# EAGLE design display (EAGLE 8.2.2)
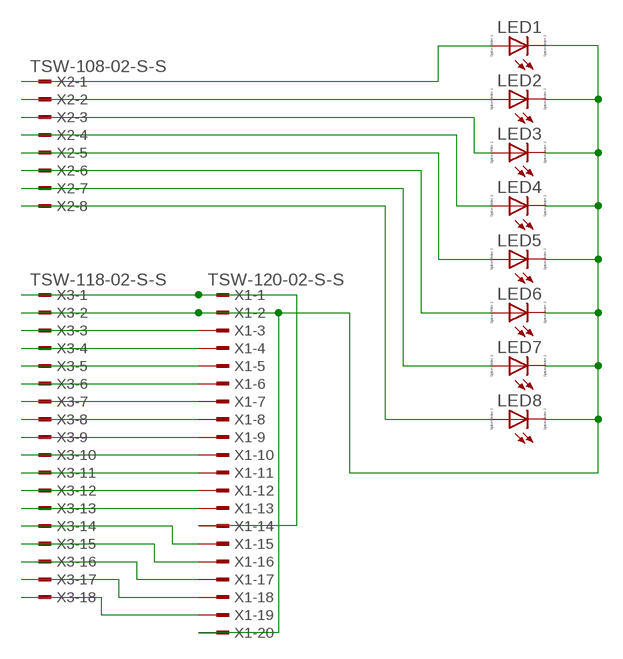
[diagram p0: schematic, sheet 1]

## Parts
LED1  LED_ELD260  [LED_LD260]
LED2  LED_ELD260  [LED_LD260]
LED3  LED_ELD260  [LED_LD260]
LED4  LED_ELD260  [LED_LD260]
LED5  LED_ELD260  [LED_LD260]
LED6  LED_ELD260  [LED_LD260]
LED7  LED_ELD260  [LED_LD260]
LED8  LED_ELD260  [LED_LD260]
X1  TSW-120-02-S-S  [TSW-120-02-S-S]
X2  TSW-108-02-S-S  [TSW-108-02-S-S]
X3  TSW-118-02-S-S  [TSW-118-02-S-S]

## Nets
GND: LED1.K(C) LED2.K(C) LED3.K(C) LED4.K(C) LED5.K(C) LED6.K(C) LED7.K(C) LED8.K(C) X1.2 X1.20 X3.2
N$1: X1.1 X1.14 X3.1
N$3: X1.3 X3.3
N$4: X1.4 X3.4
N$5: X1.5 X3.5
N$6: X1.6 X3.6
N$7: X1.7 X3.7
N$8: X1.8 X3.8
N$9: X1.9 X3.9
N$10: X1.10 X3.10
N$11: X1.11 X3.11
N$12: X1.12 X3.12
N$13: X1.13 X3.13
N$14: X1.15 X3.14
N$15: X1.16 X3.15
N$16: X1.17 X3.16
N$17: X1.18 X3.17
N$18: X1.19 X3.18
N$19: LED1.A X2.1
N$20: LED2.A X2.2
N$21: LED3.A X2.3
N$22: LED4.A X2.4
N$23: LED5.A X2.5
N$24: LED6.A X2.6
N$25: LED7.A X2.7
N$26: LED8.A X2.8

## Library data of the parts
LED1-LED8 = eagle-ltspice:LED_E: LED Source: http://www.osram.convergy.de Source: www.luxeon.com Source: www.kingbright.com; SPICEMODEL: NONE; SPICEPREFIX: D; SPICETYPE: diode
X1 = con-samtec:TSW-120-02-S-S: THROUGH-HOLE .025" SQ POST HEADER Source: Samtec TSW.pdf; OC_FARNELL: unknown; OC_NEWARK: unknown
X2 = con-samtec:TSW-108-02-S-S: THROUGH-HOLE .025" SQ POST HEADER Source: Samtec TSW.pdf; OC_FARNELL: unknown; OC_NEWARK: unknown
X3 = con-samtec:TSW-118-02-S-S: THROUGH-HOLE .025" SQ POST HEADER Source: Samtec TSW.pdf; OC_FARNELL: unknown; OC_NEWARK: unknown

## Board
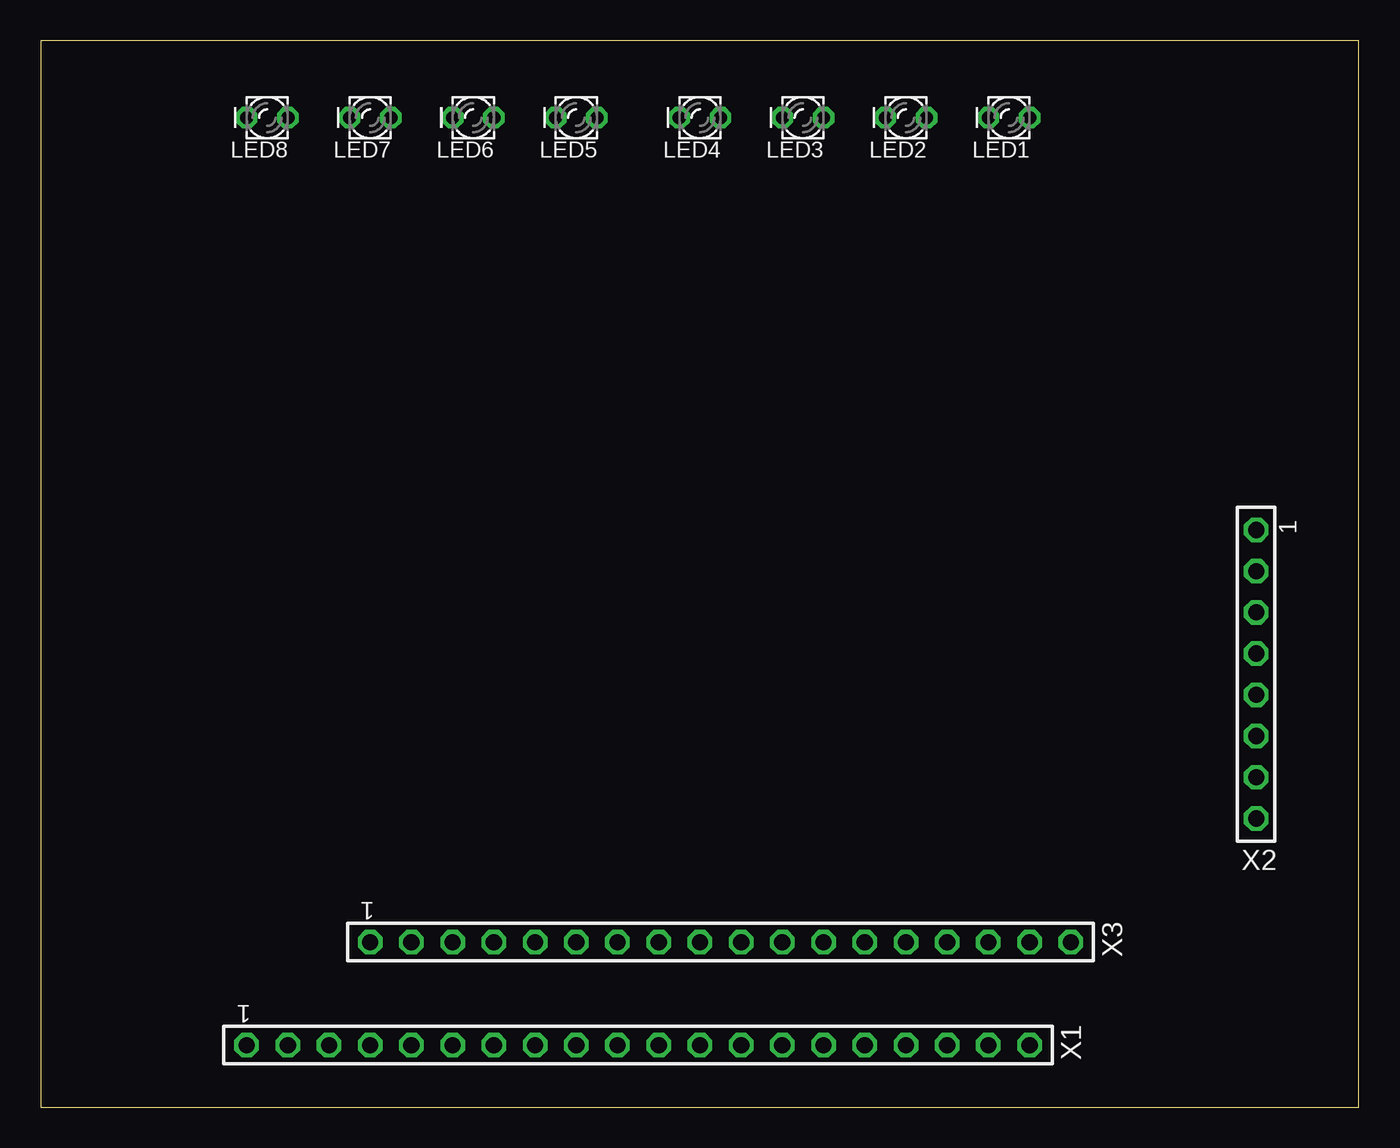
[diagram p1: board, top side]
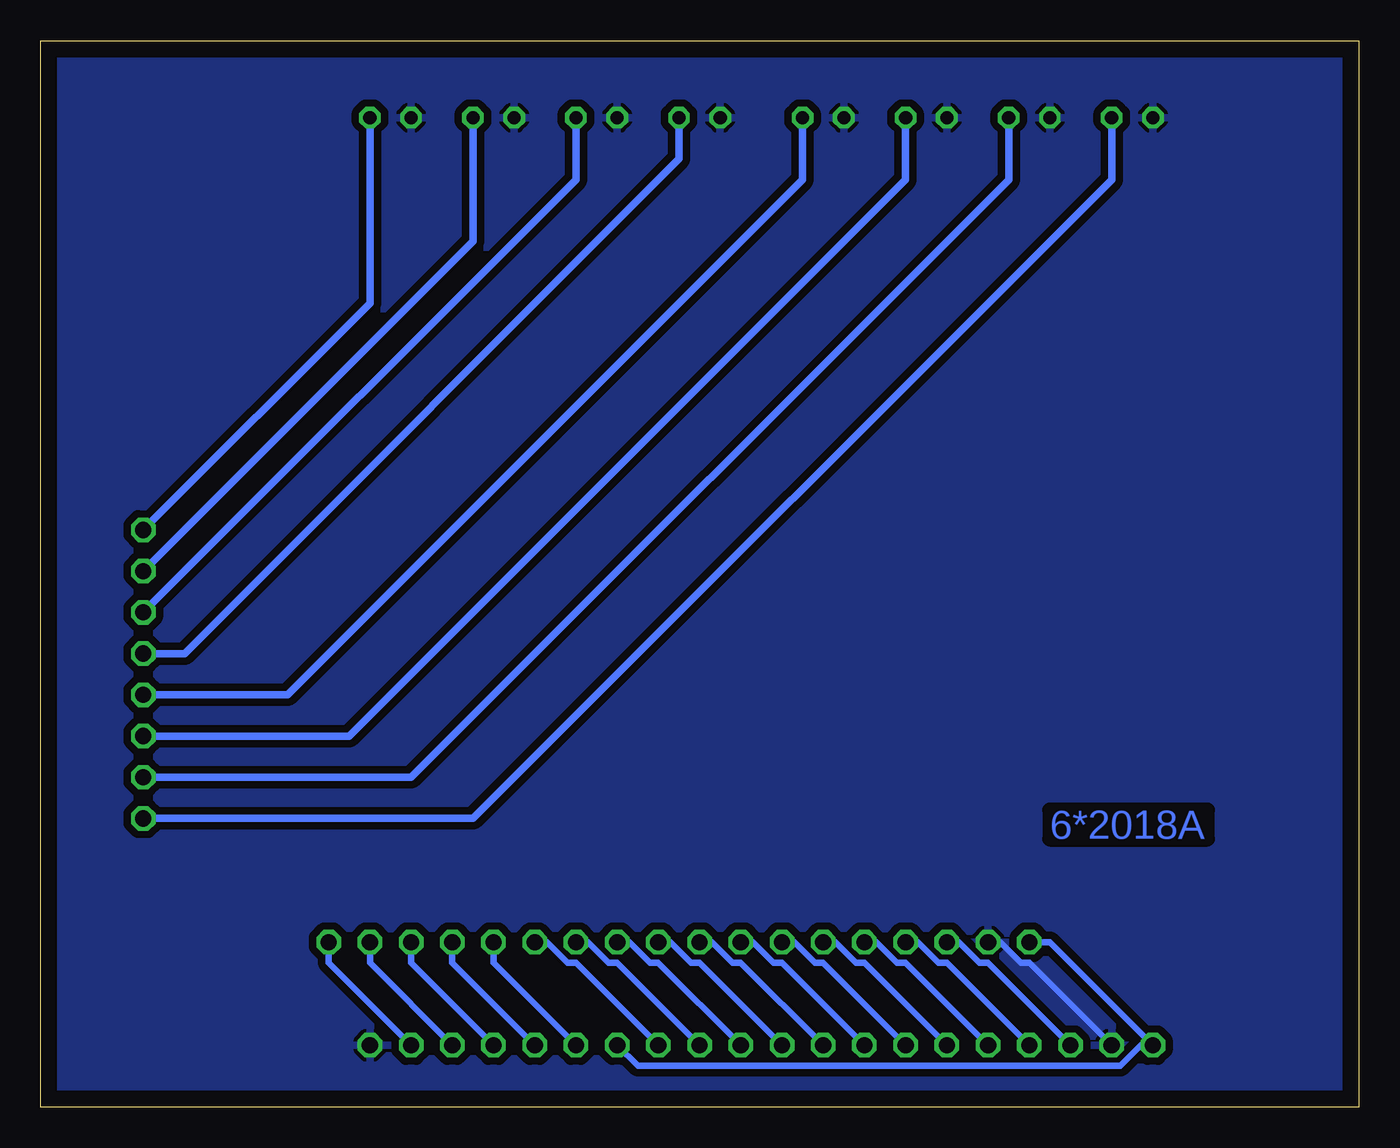
[diagram p2: board, bottom side, seen from below]

Size 81.26 x 65.71 mm. Coordinates in mm from the lower left corner, seen from the top.
Outline: 0,0 81.26,0 81.26,65.71 0,65.71 0,0
Copper layers (1*16): Top 0.035mm / dielectric 1.5mm / Bottom 0.035mm
Design rules "default *": minimum track width 6mil, minimum drill 0.35mm, track to track 12mil, track to pad 12mil, pad to pad 12mil, via to via 12mil, smd to smd 6mil, copper to edge 40mil, drill to drill 6mil, minimum pad ring 10mil, minimum via ring 8mil, stop-mask expansion 4mil, vias tented up to drill 0mil, thermal gap 10mil

### Footprints (pad centres in the part's own frame; a part is rotated, then mirrored left to right if it is on the bottom)
LED_LD260 = drill 0.813 octagon: A -1.27,0; K 1.27,0
TSW-120-02-S-S = drill 1 pad 1.5 octagon: 1 24.13,0; 2 21.59,0; 3 19.05,0; 4 16.51,0; 5 13.97,0; 6 11.43,0; 7 8.89,0; 8 6.35,0; 9 3.81,0; 10 1.27,0; 11 -1.27,0; 12 -3.81,0; 13 -6.35,0; 14 -8.89,0; 15 -11.43,0; 16 -13.97,0; 17 -16.51,0; 18 -19.05,0; 19 -21.59,0; 20 -24.13,0
TSW-108-02-S-S = drill 1 pad 1.5 octagon: 1 8.89,0; 2 6.35,0; 3 3.81,0; 4 1.27,0; 5 -1.27,0; 6 -3.81,0; 7 -6.35,0; 8 -8.89,0
TSW-118-02-S-S = drill 1 pad 1.5 octagon: 1 21.59,0; 2 19.05,0; 3 16.51,0; 4 13.97,0; 5 11.43,0; 6 8.89,0; 7 6.35,0; 8 3.81,0; 9 1.27,0; 10 -1.27,0; 11 -3.81,0; 12 -6.35,0; 13 -8.89,0; 14 -11.43,0; 15 -13.97,0; 16 -16.51,0; 17 -19.05,0; 18 -21.59,0

### Placement (x,y rotation side)
LED1  59.69,60.96 180 top
LED2  53.34,60.96 180 top
LED3  46.99,60.96 180 top
LED4  40.64,60.96 180 top
LED5  33.02,60.96 180 top
LED6  26.67,60.96 180 top
LED7  20.32,60.96 180 top
LED8  13.97,60.96 180 top
X1  36.83,3.81 180 top
X2  74.93,26.67 90 top
X3  41.91,10.16 180 top

### Tracks (layer width: path | path; a pad name or v marks a point on that pad's centre or on a via)
GND
  Bottom 0.406: X1.2 20.33,8.9 20.84,8.9 22.11,10.16 X3.2
  pour Bottom (isolate 0.457): 0,66.04 81.28,66.04 81.28,0 0,0
N$1
  Bottom 0.406: X3.1 19.05,10.16 X1.1 13.46,3.81 14.72,2.55 44.44,2.55 44.45,2.54 X1.14
N$3
  Bottom 0.406: X1.3 22.87,8.9 23.38,8.9 24.64,10.16 X3.3
N$4
  Bottom 0.406: X1.4 25.41,8.9 25.92,8.9 27.19,10.16 X3.4
N$5
  Bottom 0.406: X1.5 27.95,8.9 28.46,8.9 29.73,10.16 X3.5
N$6
  Bottom 0.406: X1.6 30.49,8.9 31,8.9 32.27,10.16 X3.6
N$7
  Bottom 0.406: X1.7 33.03,8.9 33.54,8.9 34.8,10.16 X3.7
N$8
  Bottom 0.406: X1.8 35.57,8.9 36.08,8.9 37.34,10.16 X3.8
N$9
  Bottom 0.406: X1.9 38.11,8.9 38.62,8.9 39.88,10.16 X3.9
N$10
  Bottom 0.406: X1.10 40.65,8.9 41.16,8.9 42.42,10.16 X3.10
N$11
  Bottom 0.406: X1.11 43.19,8.9 43.7,8.9 44.96,10.16 X3.11
N$12
  Bottom 0.406: X1.12 45.73,8.9 46.24,8.9 47.5,10.16 X3.12
N$13
  Bottom 0.406: X1.13 48.27,8.9 48.78,8.9 50.04,10.16 X3.13
N$14
  Bottom 0.406: X3.14 53.34,8.89 X1.15
N$15
  Bottom 0.406: X3.15 55.88,8.89 X1.16
N$16
  Bottom 0.406: X3.16 58.42,8.89 X1.17
N$17
  Bottom 0.406: X3.17 60.96,8.89 X1.18
N$18
  Bottom 0.406: X3.18 63.5,8.89 X1.19
N$19
  Bottom 0.457: LED1.A 60.96,49.53 X2.1
N$20
  Bottom 0.457: LED2.A 54.61,53.34 X2.2
N$21
  Bottom 0.457: LED3.A 48.26,57.15 X2.3
N$22
  Bottom 0.457: LED4.A 41.91,58.42 72.39,27.94 X2.4
N$23
  Bottom 0.457: LED5.A 34.29,57.15 66.04,25.4 X2.5
N$24
  Bottom 0.457: LED6.A 27.94,57.15 62.23,22.86 X2.6
N$25
  Bottom 0.457: LED7.A 21.59,57.15 58.42,20.32 X2.7
N$26
  Bottom 0.457: LED8.A 15.24,57.15 54.61,17.78 X2.8

### Text on the board
Bottom: 6*2018A